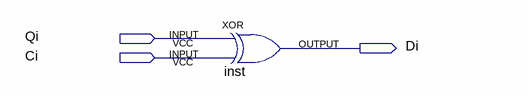
[diagram p0: schematic sheet]
// Quartus schematic Di.bdf as structural Verilog: 1 symbols, 3 pins
module Di (
  input  Qi,
  input  Ci,
  output Di
);

  xor inst (Di, Qi, Ci);
endmodule
